# Altium schematic sheet SPIFlash.SchDoc
size A; SheetNumber: 6; SheetTotal: 10
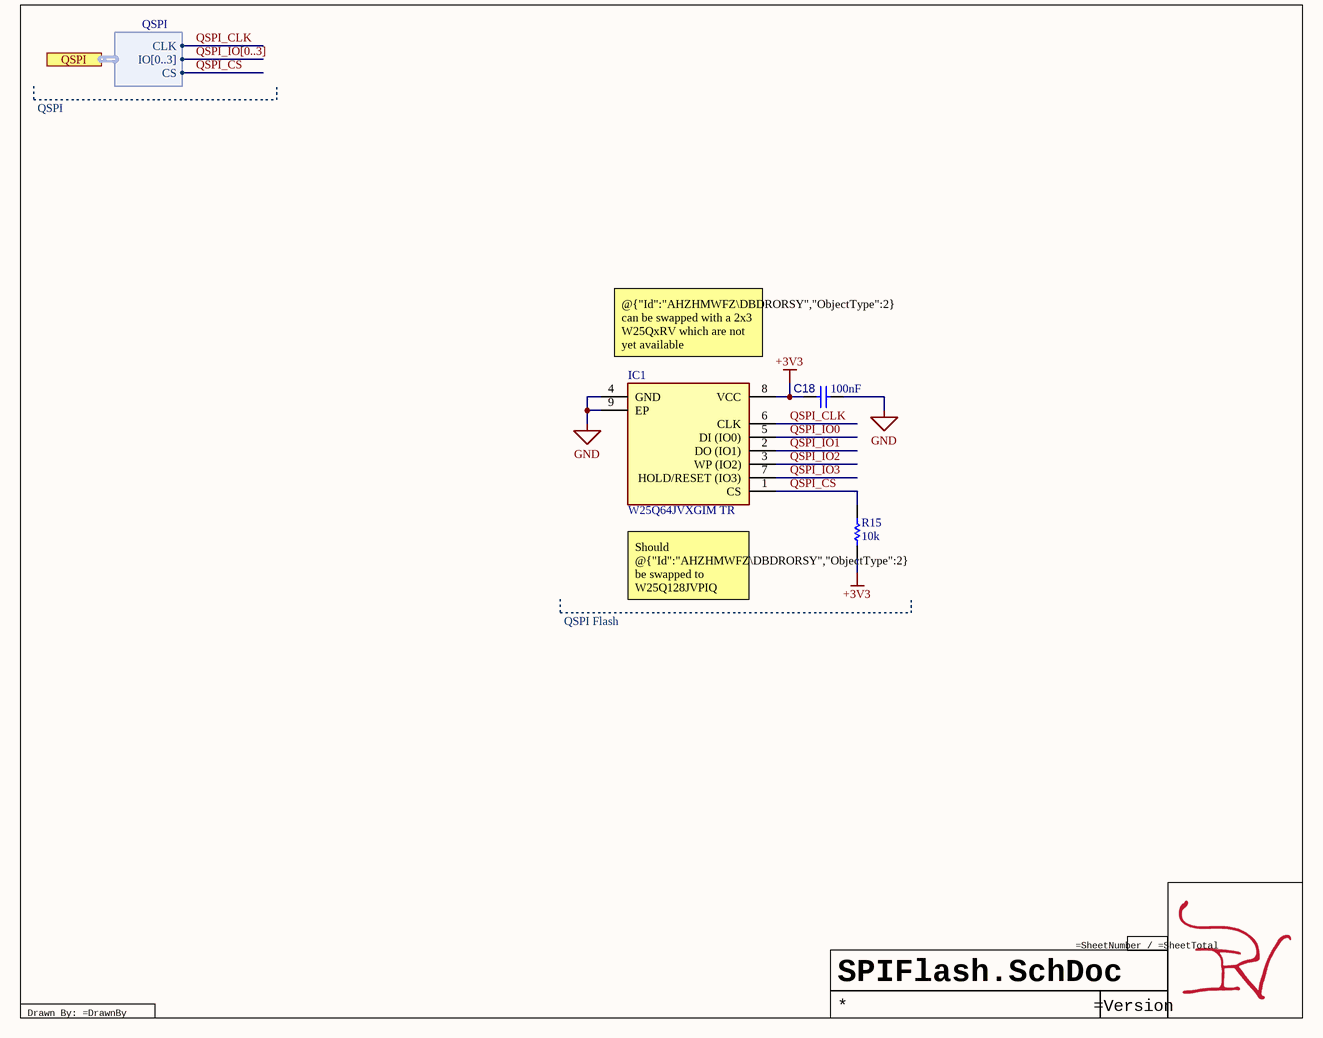
[diagram p0: SPIFlash.SchDoc]

## Parts
C18  value 100nF  [CAP 0201_0603]  (hidden comment: CL03A104KQ3NNNC)
IC1  W25Q64JVXGIM TR  [SON80P400X400X50-9N]
R15  value 10k  [RES 0201_0603]  (hidden comment: 10k-0201-0.05/1)

## Ports
QSPI (harness QSPI, see 2040Macro-PCB[3B], RP2040[1A])

## Harnesses
QSPI: CLK, IO[0..3], CS

## Nets
+3V3: C18.2 IC1.8(VCC) R15.1
GND: C18.1 IC1.4(GND) IC1.9(EP)
QSPI_CLK: IC1.6(CLK) ; port QSPI.CLK
QSPI_CS: IC1.1(CS) R15.2 ; port QSPI.CS
QSPI_IO0: IC1.5(DI_(IO0))
QSPI_IO1: IC1.2(DO_(IO1))
QSPI_IO2: IC1.3(WP_(IO2))
QSPI_IO3: IC1.7(HOLD/RESET_(IO3))

## Buses and harness runs
bus QSPI_IO[0..3]

## Notes on the sheet
- QSPI
- (near IC1) @{"Id":"AHZHMWFZ\DBDRORSY","ObjectType":2} can be swapped with a 2x3 W25QxRV which are not yet available
- QSPI Flash
- (near IC1) Should @{"Id":"AHZHMWFZ\DBDRORSY","ObjectType":2} be swapped to W25Q128JVPIQ instead?
- Drawn By: =DrawnBy

## Library data of the parts
C18 = CMP-001-00029-1: Ceramic Capacitor, Multilayer, Ceramic, 6.3V, 10% +Tol, 10% -Tol, X5R, 15% TC, 0.1uF, Surface Mount, 0201; Multilayer: Yes; Temperature Characteristics Code: X5R; Capacitor Type: Ceramic; Min Operating Temperature: -55°C; Reach SVHC Compliant: Yes; Termination: Wraparound; Mounting Technology: Surface Mount; Terminal Finish: Nickel; Pins: 2; JESD-609 Code: e3; Rated DC Voltage (URdc): 6.3V; Case/Package: 0201; Packaging: Tape and Reel; Tolerance  (fill in as +-): 10%; Height: 0.3mm; Length: 0.6mm; Package Shape: Rectangular; Max Operating Temperature: 85°C; Package Style: SMTMeter; Tolerance (fill in as +-): 10%; RoHS Compliant: Yes; Dielectric Material: Ceramic; Width: 0.3mm
IC1 = CMP-031-00008-4: NOR Flash Serial (SPI, Dual SPI, Quad SPI) 3V/3.3V 64M-bit 8M x 8 6ns 8-Pin XSON EP Tube; Manufacturer_Name: Winbond; Height: 0.5mm; Mouser Part Number: 454-W25Q64JVXGIMTR; Design Item ID: W25Q64JVXGIM_TR; Arrow Part Number: W25Q64JVXGIM TR; Datasheet Link: https://www.winbond.com/resource-files/w25q64jv_dtr%20revj%2003272018%20plus.pdf; Source: SamacSys.SchLib; Manufacturer_Part_Number: W25Q64JVXGIM TR; Arrow Price/Stock: https://www.arrow.com/en/products/w25q64jvxgim-tr/winbond-electronics?region=nac; Mouser Price/Stock: https://www.mouser.co.uk/ProductDetail/Winbond/W25Q64JVXGIM-TR?qs=qSfuJ%252Bfl%2Fd5DYf7S8uijYQ%3D%3D
R15 = CMP-009-00054-1: Fixed Resistor, Metal Glaze/thick Film, 0.05W, 10000ohm, 25V, 1% +/-Tol, 200ppm/Cel, Surface Mount, 0201; Rated Temperature: 70°C; Power: 50mW; Package Height: 0.23mm; Temperature Coefficient: 200ppm/°C; Package Width: 0.3mm; Reference Standard: AEC-Q200; Package Length: 0.6mm; RoHS Compliant: Yes; JESD-609 Code: e3; Resistor Type: FIXED RESISTOR; Termination: Wraparound; Pins: 2; Technology: METAL GLAZE/THICK FILM; Terminal Finish: Nickel; Mounting Technology: Surface Mount; Package Shape: Rectangular; Reach SVHC Compliant: Yes; Package Style: SMTMeter; Case/Package: 0201; Working Voltage: 25V; Packaging: Tape and Reel; Construction: Rectangular; Max Operating Temperature: 125°C; Min Operating Temperature: -55°C; Tolerance: 1%